# EAGLE design AirPi1-4 (EAGLE 6.5.0)
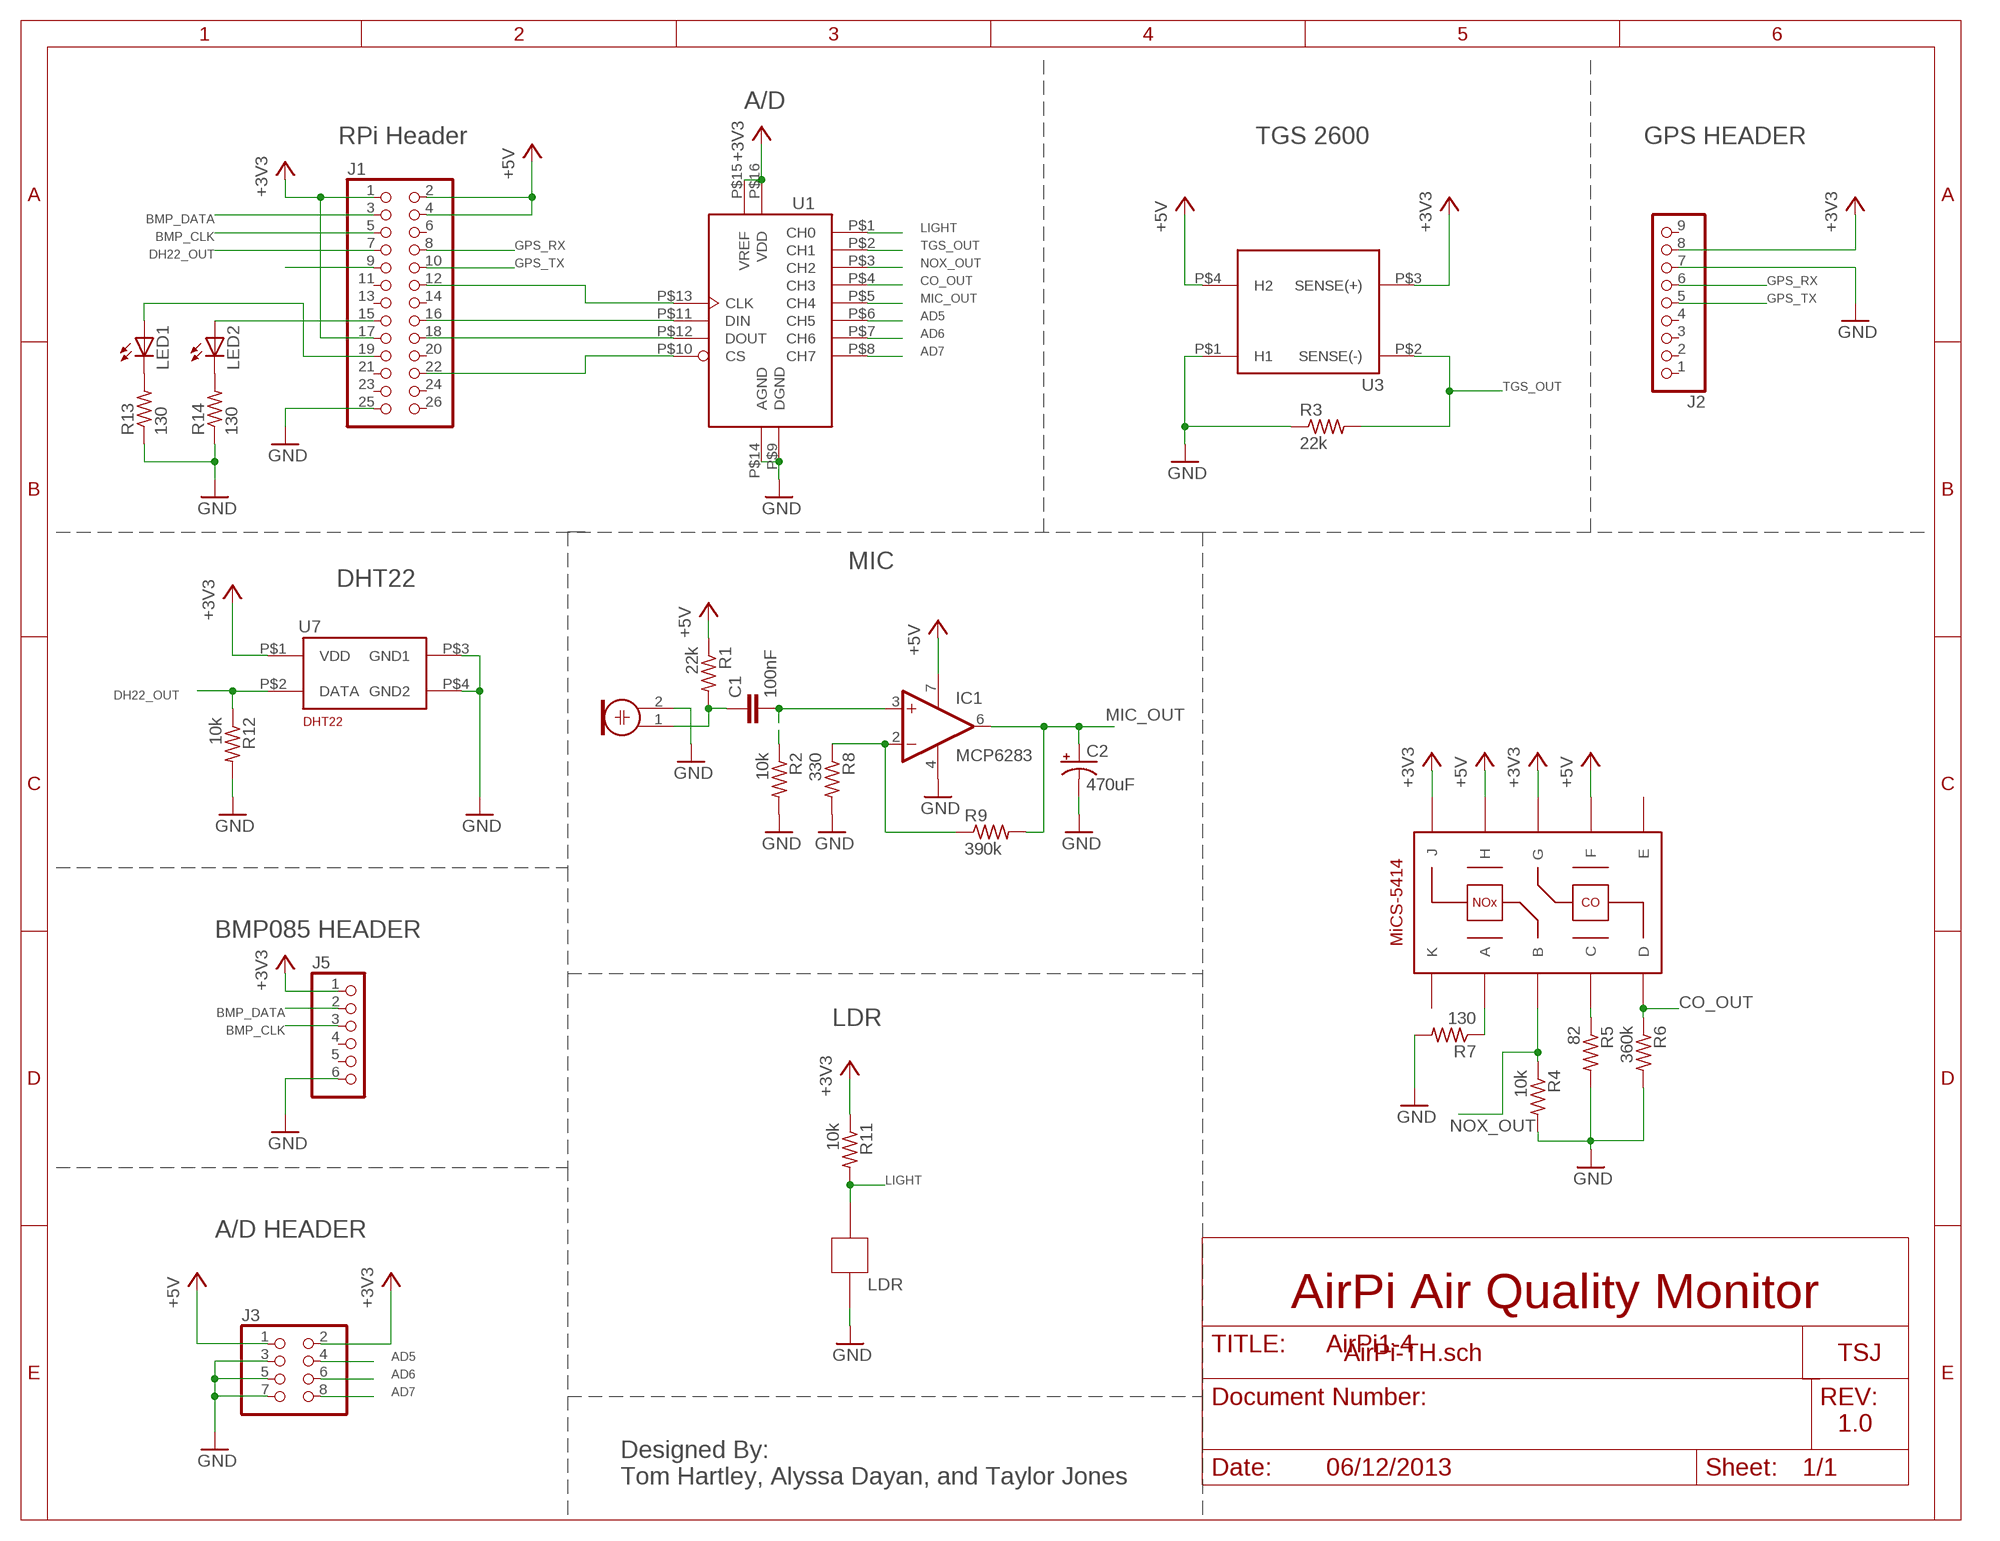
[diagram p0: schematic, sheet 1]

## Parts
C1  100nF  C2.5/4  [C2.5-4]
C2  470uF  CPOL-USE3.5-8  [E3,5-8]
IC1  MCP6283  OPA344P  [DIL08]
IC2  MCP3008  MCP30081  [DIL16]
J1  PINHD-2X13  [2X13]
J2  PINHD-1X9  [1X09-BIG]
J3  PINHD-2X4  [2X04]
J5  PINHD-1X6  [1X06]
LDR1  LDR  [LED5MM]
LED1  LED3MM  [LED3MM]
LED2  LED3MM  [LED3MM]
M1  MIC  ELECTRET_MICROPHON-WM-62PC/62PK  [WM-62PC/62PK]
MICS  MICS-4514  [MICS-4514]
R1  22k  R-US_0207/10  [0207/10]
R2  10k  R-US_0207/10  [0207/10]
R3  22k  R-US_0207/10  [0207/10]
R4  10k  R-US_0207/10  [0207/10]
R5  82  R-US_0207/10  [0207/10]
R6  360k  R-US_0207/10  [0207/10]
R7  130  R-US_0207/10  [0207/10]
R8  330  R-US_0207/10  [0207/10]
R9  390k  R-US_0207/10  [0207/10]
R11  10k  R-US_0207/10  [0207/10]
R12  10k  R-US_0207/10  [0207/10]
R13  130  R-US_0207/10  [0207/10]
R14  130  R-US_0207/10  [0207/10]
U3  TGS2600  [TGS2600]
U7  DHT22  [DHT22]

## Nets
+3V3 [power]: IC2.P$15(VREF) IC2.P$16(VDD) J1.1 J1.17 J2.8 J3.2 J5.1 MICS.G MICS.J R11.1 U3.P$3(SENSE(+)) U7.P$1(VDD)
+5V [power]: IC1.7(V+) J1.2 J1.4 J3.1 MICS.F MICS.H R1.1 U3.P$4(H2)
AD5: IC2.P$6(CH5) J3.4
AD6: IC2.P$7(CH6) J3.6
AD7: IC2.P$8(CH7) J3.8
BMP_CLK: J1.5 J5.3
BMP_DATA: J1.3 J5.2
CO_OUT: IC2.P$4(CH3) MICS.D R6.1
DH22_OUT: J1.7 R12.1 U7.P$2(DATA)
GND: C2.- IC1.4(V-) IC2.P$9(DGND) IC2.P$14(AGND) J1.25 J2.7 J3.3 J3.5 J3.7 J5.6 LDR1.K M1.2 R2.2 R3.1 R4.2 R5.2 R6.2 R7.2 R8.2 R12.2 R13.1 R14.1 U3.P$1(H1) U7.P$3(GND1) U7.P$4(GND2)
GPS_RX: J1.8 J2.6
GPS_TX: J1.10 J2.5
LIGHT: IC2.P$1(CH0) LDR1.A R11.2
MIC_OUT: C2.+ IC1.6(OUT) IC2.P$5(CH4) R9.2
N$1: IC2.P$13(CLK) J1.12
N$2: IC2.P$12(DOUT) J1.18
N$3: IC2.P$10(CS) J1.22
N$4: IC2.P$11(DIN) J1.16
N$6: MICS.C R5.1
N$7: C1.1 M1.1 R1.2
N$8: C1.2 IC1.3(+IN) R2.1
N$10: IC1.2(-IN) R8.1 R9.1
N$11: MICS.A R7.1
N$13: J1.9
N$18: LED1.K(C) R13.2
N$19: LED2.K(C) R14.2
N$21: J1.19 LED1.A
N$22: J1.15 LED2.A
NOX_OUT: IC2.P$3(CH2) MICS.B R4.1
TGS_OUT: IC2.P$2(CH1) R3.2 U3.P$2(SENSE(-))
Unconnected: J1.6 J1.11 J1.13 J1.14 J1.20 J1.21 J1.23 J1.24 J1.26 J2.1 J2.2 J2.3 J2.4 J2.9 J5.4 J5.5 MICS.E MICS.K

## Notes on the sheet
- A/D
- RPi Header | TGS 2600 | GPS HEADER
- U1
- U3
- MIC
- DHT22
- U7
- BMP085 HEADER
- LDR
- A/D HEADER
- LDR
- AirPi Air Quality Monitor
- AirPi-TH.sch | TSJ
- 1.0
- 06/12/2013
- Designed By:
  Tom Hartley, Alyssa Dayan, and Taylor Jones

## Library data of the parts
C1 = capacitor-wima:C: CAPACITOR naming: grid - package width
C2 = rcl:CPOL-US: POLARIZED CAPACITOR, American symbol
IC1 = linear:OPA*: Single Operational Amplifier Low Power, Single-Supply, Rail-To-Rail Operational Amplifier Source: http://focus.ti.com/lit/ds/symlink/opa2345.pdf
IC2 = tjones:MCP3008
J1 = pinhead:PINHD-2X13: PIN HEADER
J2 = adafruit:PINHD-1X9: Pin header 1x10 0.1" spacing With round pins
J3 = adafruit:PINHD-2X4: PIN HEADER
J5 = adafruit:PINHD-1X6: PIN HEADER
LDR1 = tjones:LDR
LED1 LED2 = adafruit:LED: LED OSRAM: - CHIPLED LG R971, LG N971, LY N971, LG Q971, LY Q971, LO R971, LY R971 LH N974, LH R974 LS Q976, LO Q976, LY Q976 LO Q996 - Hyper CHIPLED LW Q18S LB Q993, LB Q99A, LB R99A - SideLED LS A670, LO A670, LY A670, LG A670, LP A670 LB A673, LV A673, LT A673, LW A673 LH A674 LY A675 LS A676, LA A676, LO A676, LY A676, LW A676 LS A679, LY A679, LG A679 - Hyper Micro SIDELED® LS Y876, LA Y876, LO Y876, LY Y876 LT Y87S - SmartLED LW L88C, LW L88S LB L89C, LB L89S, LG L890 LS L89K, LO L89K, LY L89K LS L896, LA L896, LO L896, LY L896 - TOPLED LS T670, LO T670, LY T670, LG T670, LP T670 LSG T670, LSP T670, LSY T670, LOP T670, LYG T670 LG T671, LOG T671, LSG T671 LB T673, LV T673, LT T673, LW T673 LH T674 LS T676, LA T676, LO T676, LY T676, LB T676, LH T676, LSB T676, LW T676 LB T67C, LV T67C, LT T67C, LS T67K, LO T67K, LY T67K, LW E67C LS E67B, LA E67B, LO E67B, LY E67B, LB E67C, LV E67C, LT E67C LW T67C LS T679, LY T679, LG T679 LS T770, LO T770, LY T770, LG T770, LP T770 LB T773, LV T773, LT T773, LW T773 LH T774 LS E675, LA E675, LY E675, LS T675 LS T776, LA T776, LO T776, LY T776, LB T776 LHGB T686 LT T68C, LB T68C - Hyper Mini TOPLED® LB M676 - Mini TOPLED Santana® LG M470 LS M47K, LO M47K, LY M47K Source: http://www.osram.convergy.de/
M1 = microphon:ELECTRET_MICROPHON-: Electret Condenser Microphone
MICS = TH:MICS-4514
R1-R9 R11-R14 = adafruit:R-US_: RESISTOR, American symbol
U3 = tjones:TGS2600
U7 = tjones:DHT22

## Net classes
0 signal: width 0.203 mm, drill 0.001 mm
1 power: width 0.406 mm, drill 0.001 mm

## Board
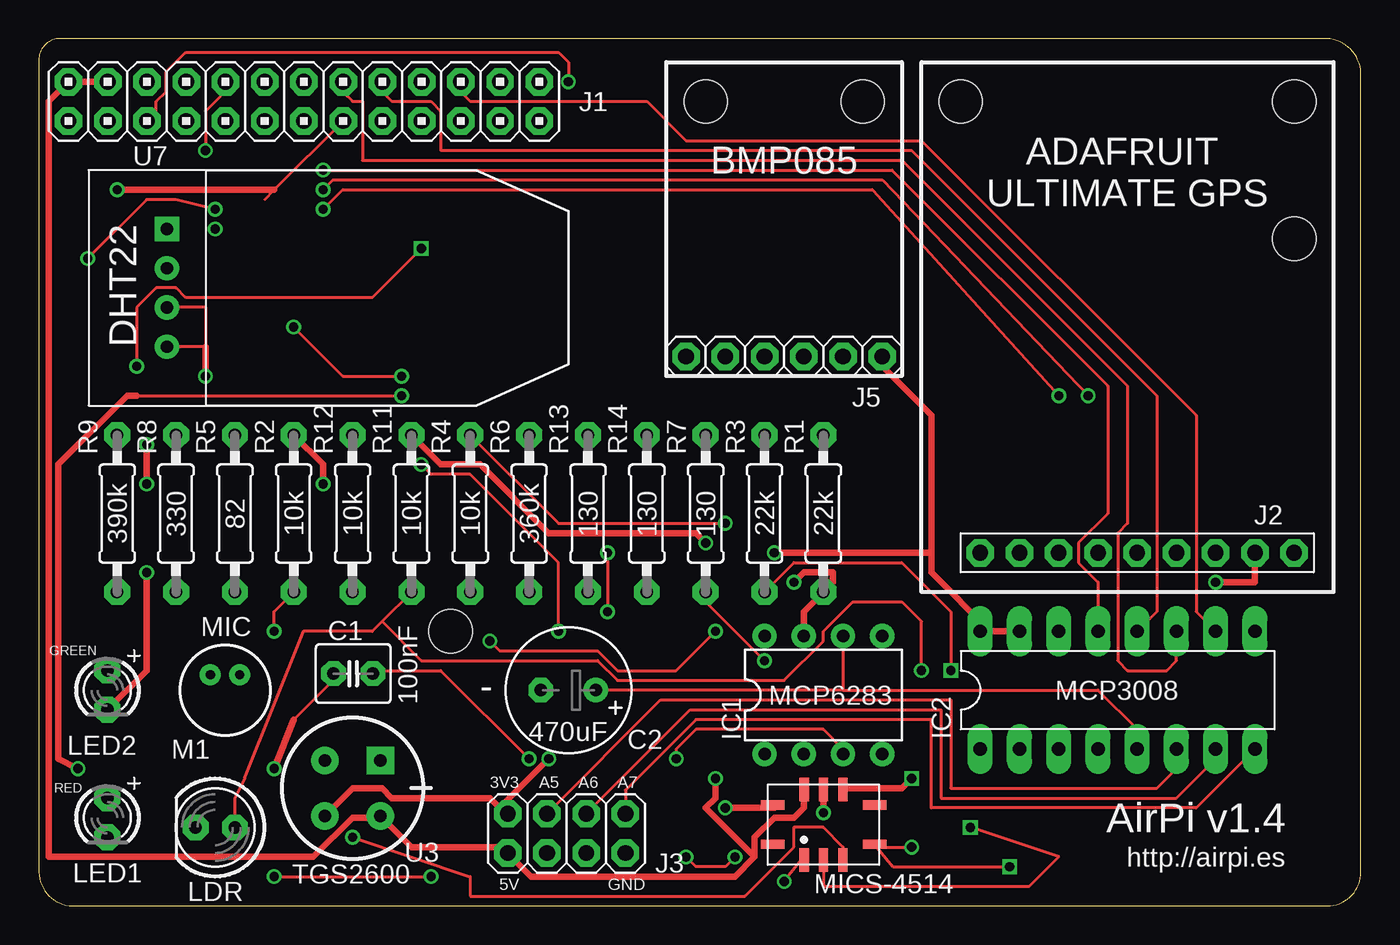
[diagram p1: board, top side]
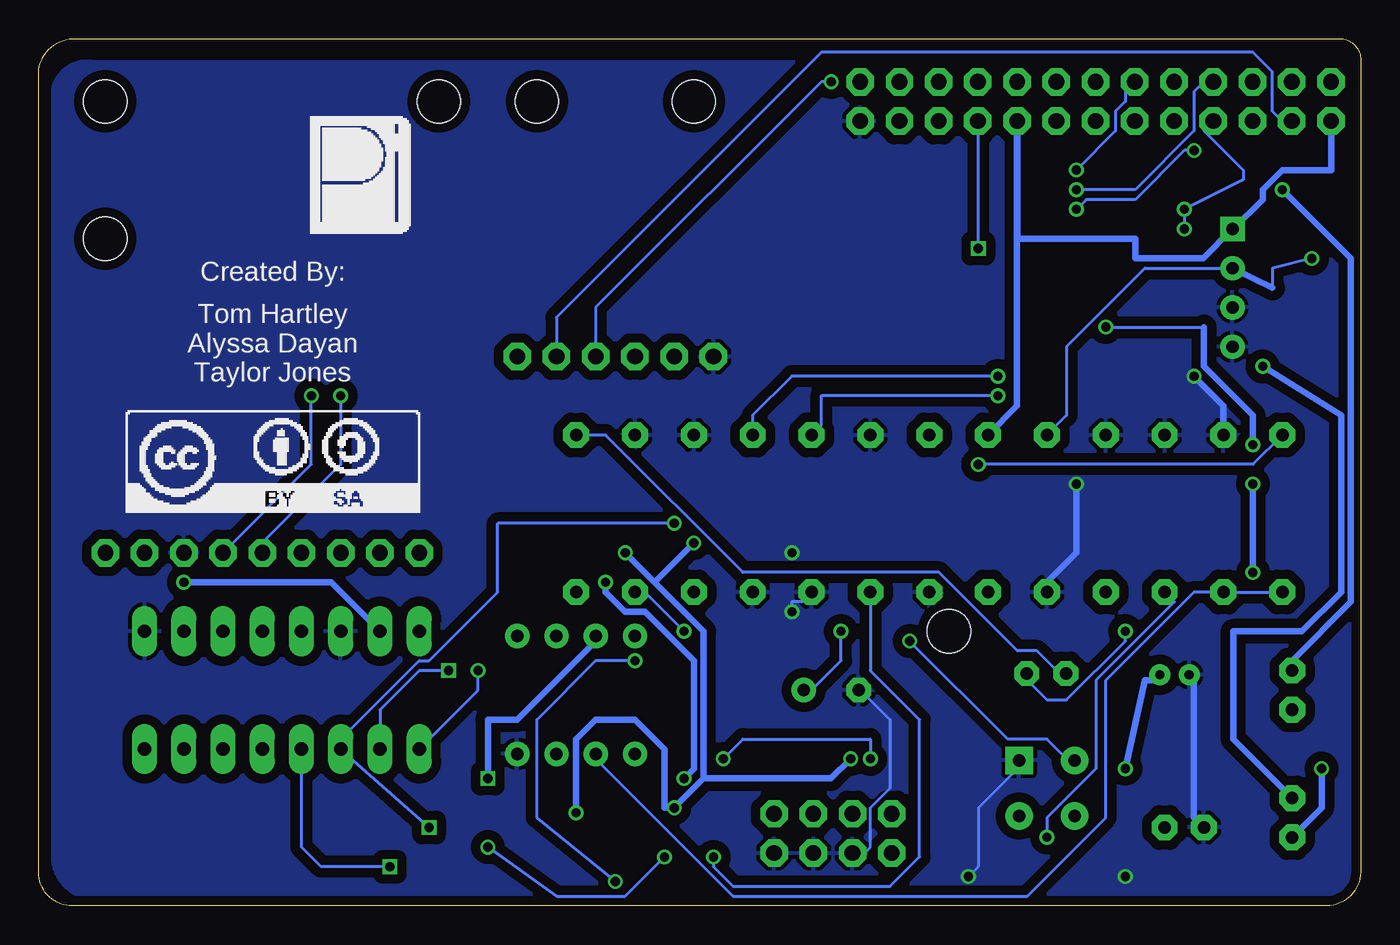
[diagram p2: board, bottom side, seen from below]

Size 85.61 x 56.13 mm. Coordinates in mm from the lower left corner, seen from the top.
Outline: 0.01,54.6 0.01,2.19 arc90 2.39,0 83.42,0 arc90 85.6,2.19 85.6,53.7 arc90 83.42,56.13 1.29,56.13 arc90 0.01,54.6
Copper layers (1*16): Top 0.0356mm / dielectric 1.5011mm / Bottom 0.0356mm
Design rules "LaenPCBOrder *": minimum track width 6mil, minimum drill 13mil, track to track 6mil, track to pad 6mil, pad to pad 6mil, via to via 6mil, smd to smd 6mil, copper to edge 15mil, drill to drill 6mil, minimum pad ring 15mil, minimum via ring 7mil, stop-mask expansion 4mil, vias tented up to drill 0mil, thermal gap 10mil
Holes 2.8 mm at 26.68,17.78 81.29,43.18 53.35,52.07 81.29,52.07 59.7,52.07 43.19,52.07

### Footprints (pad centres in the part's own frame; a part is rotated, then mirrored left to right if it is on the bottom)
C2.5-4 = drill 0.813 pad 1.6 octagon: 1 -1.27,0; 2 1.27,0
E3,5-8 = drill 0.813 pad 1.6: + -1.778,0 | drill 0.813 pad 1.6 octagon: - 1.778,0
DIL08 = drill 0.813 pad 1.27: 1 -3.81,-3.81; 2 -1.27,-3.81; 3 1.27,-3.81; 4 3.81,-3.81; 5 3.81,3.81; 6 1.27,3.81; 7 -1.27,3.81; 8 -3.81,3.81
DIL16 = drill 0.864 long: P$1 -8.89,-3.81; P$2 -6.35,-3.81; P$3 -3.81,-3.81; P$4 -1.27,-3.81; P$5 1.27,-3.81; P$6 3.81,-3.81; P$7 6.35,-3.81; P$8 8.89,-3.81; P$9 8.89,3.81; P$10 6.35,3.81; P$11 3.81,3.81; P$12 1.27,3.81; P$13 -1.27,3.81; P$14 -3.81,3.81; P$15 -6.35,3.81; P$16 -8.89,3.81
2X13 = drill 1.016 octagon: 1 -15.24,-1.27; 2 -15.24,1.27; 3 -12.7,-1.27; 4 -12.7,1.27; 5 -10.16,-1.27; 6 -10.16,1.27; 7 -7.62,-1.27; 8 -7.62,1.27; 9 -5.08,-1.27; 10 -5.08,1.27; 11 -2.54,-1.27; 12 -2.54,1.27; 13 0,-1.27; 14 0,1.27; 15 2.54,-1.27; 16 2.54,1.27; 17 5.08,-1.27; 18 5.08,1.27; 19 7.62,-1.27; 20 7.62,1.27; 21 10.16,-1.27; 22 10.16,1.27; 23 12.7,-1.27; 24 12.7,1.27; 25 15.24,-1.27; 26 15.24,1.27
1X09-BIG = drill 1.016 pad 1.778 octagon: 1 -10.16,0; 2 -7.62,0; 3 -5.08,0; 4 -2.54,0; 5 0,0; 6 2.54,0; 7 5.08,0; 8 7.62,0; 9 10.16,0
2X04 = drill 1.016 pad 1.676 octagon: 1 -3.81,-1.27; 2 -3.81,1.27; 3 -1.27,-1.27; 4 -1.27,1.27; 5 1.27,-1.27; 6 1.27,1.27; 7 3.81,-1.27; 8 3.81,1.27
1X06 = drill 1.016 octagon: 1 -6.35,0; 2 -3.81,0; 3 -1.27,0; 4 1.27,0; 5 3.81,0; 6 6.35,0
LED5MM = drill 0.813 pad 1.676 octagon: A -1.27,0; K 1.27,0
LED3MM = drill 0.813 pad 1.676 octagon: A -1.27,0; K 1.27,0
WM-62PC/62PK = drill 0.6 pad 1: 1 -1,0.95; 2 -1,-0.95
MICS-4514 = smd 0.6 x 1.524: A -1.25,-2.286; B 0,-2.286; C 1.25,-2.286; F 1.25,2.286; G 0,2.286; H -1.25,2.286 | smd 1.524 x 0.6: D 3.302,-1.27; E 3.302,1.27; J -3.302,1.27; K -3.302,-1.27
0207/10 = drill 0.813 pad 1.676 octagon: 1 -5.08,0; 2 5.08,0
TGS2600 = drill 0.8 pad 1.778 square: P$1 -1.803,1.803 | drill 0.8 pad 1.778: P$2 -1.803,-1.803; P$3 1.803,-1.803; P$4 1.803,1.803
DHT22 = drill 0.8 square: P$1 0,0 | drill 0.8: P$2 2.54,0; P$3 5.08,0; P$4 7.62,0

### Placement (x,y rotation side)
C1  20.36,15.04 0 top
C2  34.3,13.97 180 top
IC1  50.81,13.65 0 top
IC2  69.86,13.97 0 top
J1  17.18,52.07 0 top
J2  71.13,22.86 0 top
J3  34.18,4.7 0 top
J5  48.27,35.56 180 top
LDR1  11.44,5.08 180 top
LED1  4.45,5.71 270 top
LED2  4.45,13.97 270 top
M1  12.07,13.97 270 top
MICS  50.82,5.27 0 top
R1  50.81,25.4 90 top
R2  16.52,25.4 90 top
R3  47,25.4 270 top
R4  27.95,25.4 270 top
R5  12.71,25.4 90 top
R6  31.76,25.4 90 top
R7  43.19,25.4 90 top
R8  8.9,25.4 90 top
R9  5.09,25.4 90 top
R11  24.14,25.4 270 top
R12  20.33,25.4 270 top
R13  35.57,25.4 90 top
R14  39.38,25.4 90 top
U3  20.33,7.62 270 top
U7  8.31,43.81 270 top

### Tracks (layer width: path | path; a pad name or v marks a point on that pad's centre or on a via)
+3V3  (via drill 0.6)
  Top 0.406: U3.P$3 20.33,7.62 22.23,7.62 22.87,6.99 29.22,6.99 29.85,6.35 | 29.85,6.35 v33.03,9.53 | 29.85,6.35 J3.2 | v44.46,6.35 47.63,6.35 MICS.J | 61.6,17.78 IC2.P$15 | v76.21,20.95 78.75,20.95 J2.8 | 57.79,22.86 57.79,21.59 61.6,17.78 | 57.79,22.86 57.79,31.75 54.62,34.92 J5.1 | 61.6,17.78 IC2.P$16 | v47.63,22.86 57.79,22.86 | v43.19,23.5 42.55,24.13 33.03,24.13 28.58,28.57 26.04,28.57 R11.1 | 50.81,7.62 MICS.G 50.81,6.99 v50.81,6.03
  Bottom 0.406: 42.55,8.26 34.3,8.26 v33.03,9.53 | 42.55,8.26 v44.46,6.35 45.09,6.35 45.09,10.16 47,12.06 49.54,12.06 50.81,10.79 v50.81,6.03 | v76.21,20.95 66.68,20.95 IC2.P$15 | 45.73,20.95 42.55,17.78 42.55,8.26 | 45.73,20.95 v47.63,22.86 | v43.19,23.5 45.73,20.95 | J1.1 1.91,50.8 1.91,47.62 5.09,47.62 6.36,46.35 6.36,45.72 8.26,43.81 U7.P$1 10.22,41.91 14.61,41.91 14.61,43.18 22.23,43.18 22.23,50.8 J1.17 22.26,32.36 R11.1
+5V  (via drill 0.6)
  Top 0.406: IC1.7 49.54,19.05 R1.1 51.44,20.95 51.44,21.59 49.54,21.59 v48.9,20.95 | v56.52,8.26 55.89,7.62 52.08,7.62 52.07,7.61 MICS.F | 46.36,3.17 45.09,1.91 31.9,1.91 J3.1 29.85,3.81 24.14,3.81 U3.P$4 21.6,5.71 20.33,5.71 17.79,3.17 0.64,3.17 0.64,52.07 1.91,53.34 J1.2 J1.4 | 46.36,3.17 46.36,4.45 47.63,5.71 48.9,5.71 49.54,6.35 49.54,6.99 MICS.H | v43.82,8.26 43.82,6.99 43.19,6.35 46.36,3.17
  Bottom 0.406: v56.52,8.26 56.52,12.06 54.62,12.06 49.54,17.14 IC1.7 | v48.9,20.95 48.9,20.32 47.63,19.05 46.36,19.05 43.19,15.88 43.19,8.89 v43.82,8.26
AD5
  Top 0.203: J3.4 40.28,13.34 59.06,13.34 59.06,7.62 72.4,7.62 73.67,8.89 IC2.P$6
AD6
  Top 0.203: J3.6 42.18,12.7 58.43,12.7 58.43,6.99 73.67,6.99 76.21,9.53 IC2.P$7
AD7
  Top 0.203: IC2.P$8 74.94,6.35 57.79,6.35 57.79,12.06 42.55,12.06 37.99,7.51 J3.8
BMP_CLK  (via drill 0.6)
  Top 0.203: v34.3,53.34 34.3,54.61 33.66,55.24 9.53,55.24 8.26,53.98 8.26,52.7 7.63,52.07 7.63,50.8 J1.5
  Bottom 0.203: J5.3 49.54,38.73 34.93,53.34 v34.3,53.34
BMP_DATA
  Bottom 0.203: J5.2 52.08,38.1 34.93,55.24 6.99,55.24 5.72,53.98 5.72,51.44 5.09,50.8 J1.3
CO_OUT  (via drill 0.6)
  Top 0.203: v62.87,2.54 55.31,2.54 MICS.D 53.98,3.81 v56.52,3.81 | v41.92,3.17 42.55,2.54 44.46,2.54 v45.09,3.17
  Bottom 0.203: v62.87,2.54 67.32,2.54 68.59,3.81 IC2.P$4 | R6.1 31.76,15.24 28.58,12.06 28.58,3.17 30.49,1.27 40.65,1.27 41.92,2.54 v41.92,3.17 | v45.09,3.17 47.63,0.64 52.08,0.64 v56.52,3.81
DH22_OUT  (via drill 0.6)
  Top 0.203: v3.18,41.91 6.99,45.72 8.9,45.72 v11.44,45.09
  Bottom 0.203: R12.1 19.06,31.75 19.06,36.2 13.98,41.27 U7.P$2 | J1.7 10.17,50.8 10.17,50.16 7.63,47.62 7.63,46.99 v11.44,45.09 v11.44,43.81 | 5.72,40.01 5.72,41.27 v3.18,41.91
  Bottom 0.406: 5.72,40.01 U7.P$2
GND  (via drill 0.6)
  Top 0.203: v36.84,22.86 v36.84,19.05 | v15.25,1.91 v25.41,1.91 | U7.P$3 10.8,38.73 10.8,36.2 U7.P$4
  Top 0.406: 10.8,36.2 v10.8,34.29 | v18.42,27.3 18.42,28.57 R2.2
  Bottom 0.203: J3.3 32.39,3.17 31.76,3.81 31.76,6.35 30.49,7.62 30.49,12.06 32.39,13.97 C2.- | R13.1 36.2,19.68 36.84,19.68 v36.84,19.05 | U3.P$1 22.23,8.89 24.77,6.35 24.77,2.54 v25.41,1.91
  Bottom 0.406: R8.2 8.9,32.38 v10.8,34.29 | v18.42,27.3 18.42,22.86 20.33,20.95 R12.2 | M1.2 10.8,14.61 10.8,5.71 LDR1.K
  pour Bottom (isolate 0.61): 0.62,54.62 82.01,54.61 arc-90 84.7,52.85 84.7,3.2 arc-90 81.89,0.46 3.07,0.46 arc-90 0.62,2.17
GPS_RX  (via drill 0.6)
  Top 0.203: v67.95,33.02 54.62,46.99 19.06,46.99 v18.42,46.35
  Bottom 0.203: v67.95,33.02 67.95,28.57 J2.6 | v18.42,46.35 14.61,46.35 10.8,50.16 10.8,52.7 10.17,53.34 J1.8
GPS_TX  (via drill 0.6)
  Top 0.203: v66.05,33.02 53.98,46.35 19.69,46.35 v18.42,45.09 | v10.8,48.9 10.8,51.44 12.71,53.34 J1.10
  Bottom 0.203: J2.5 71.13,23.5 66.05,28.57 v66.05,33.02 | v18.42,45.09 17.79,45.72 14.61,45.72 11.44,48.9 v10.8,48.9
LIGHT  (via drill 0.6)
  Top 0.203: R11.2 22.23,18.41 | 22.23,18.41 21.6,17.78 17.15,17.78 13.34,8.26 12.71,6.99 LDR1.A | 22.23,18.41 24.77,15.88 36.2,15.88 37.47,14.61 48.27,14.61 50.81,17.14 50.81,17.78 52.71,19.68 55.89,19.68 57.16,18.41 v57.16,15.24
  Bottom 0.203: v57.16,15.24 57.16,13.97 IC2.P$1
MIC_OUT  (via drill 0.6)
  Top 0.203: 52.08,13.97 68.59,13.97 71.13,11.43 IC2.P$5 | IC1.6 52.08,13.97 | 52.08,13.97 51.76,13.97 C2.+ | v24.77,28.57 25.41,27.94 27.95,27.94 33.66,22.23 v33.66,17.78
  Bottom 0.203: v24.77,28.57 6.99,28.57 R9.2 | v33.66,17.78 33.66,15.88 35.57,13.97 C2.+
N$1  (via drill 0.6)
  Top 0.203: IC2.P$13 68.59,20.95 67.32,22.23 67.32,23.5 69.22,25.4 69.22,33.66 55.25,47.62 v18.42,47.62
  Bottom 0.203: v18.42,47.62 15.88,50.16 15.88,51.44 15.25,52.07 15.25,53.34 J1.12
N$2
  Top 0.203: J1.18 22.26,52.68 22.87,52.07 25.41,52.07 26.04,51.44 26.04,48.9 56.52,48.9 72.4,33.02 72.4,19.05 IC2.P$12
N$3
  Top 0.203: J1.22 27.34,52.68 27.95,52.07 39.38,52.07 41.92,49.53 57.16,49.53 74.94,31.75 74.94,19.05 IC2.P$10
N$4
  Top 0.203: J1.16 19.72,52.73 19.69,52.7 20.33,52.07 20.96,52.07 20.96,48.26 55.89,48.26 70.49,33.66 70.49,24.77 69.86,24.13 69.86,15.88 70.49,15.24 73.03,15.24 73.67,15.88 IC2.P$11
N$6  (via drill 0.6)
  Top 0.203: MICS.C 52.08,3.17 52.08,3.81 50.81,5.08 48.9,5.08 48.9,3.81 45.73,0.64 27.95,0.64 27.95,1.91 v20.33,4.45
  Bottom 0.203: v20.33,4.45 20.33,5.71 17.15,8.89 17.15,14.61 12.07,19.68 R5.1
N$7  (via drill 0.6)
  Top 0.203: 16.52,12.06 19.06,14.61 C1.1
  Top 0.406: 16.52,12.06 v15.25,8.89
  Bottom 0.203: R1.2 48.9,30.48 40.01,21.59 27.31,21.59 22.23,16.51 20.96,16.51 19.69,15.24 C1.1
  Bottom 0.406: v15.25,8.89 13.98,14.61 13.34,14.61 M1.1
N$8  (via drill 0.6)
  Top 0.203: v15.25,17.78 15.25,19.05 R2.1 | v31.76,9.53 26.04,15.24 22.23,15.24 C1.2 | v41.28,9.53 41.28,10.16 42.55,11.43 50.81,11.43 52.08,10.16 IC1.3
  Bottom 0.203: v15.25,17.78 15.25,17.14 19.06,13.34 20.33,13.34 21.6,14.61 C1.2 | v41.28,9.53 40.01,10.79 31.76,10.79 v31.76,9.53
N$10
  Bottom 0.203: R9.1 R8.1 10.8,20.32 16.52,14.61 16.52,5.71 21.6,0.64 40.65,0.64 49.54,9.53 IC1.2
N$11  (via drill 0.6)
  Top 0.203: v47,15.88 43.19,19.68 R7.1 | v48.27,1.59 49.54,3.17 MICS.A
  Bottom 0.203: v47,15.88 49.54,15.88 53.35,12.06 53.35,5.71 v48.27,1.59
N$18  (via drill 0.6)
  Top 0.203: 6.36,33.02 v23.5,33.02
  Top 0.406: v2.55,8.89 1.28,9.53 1.28,28.57 5.72,33.02 6.36,33.02
  Bottom 0.203: v23.5,33.02 34.93,33.02 34.93,31.11 R13.2
  Bottom 0.406: LED1.K 2.55,6.35 v2.55,8.89
N$19  (via drill 0.6)
  Top 0.203: v23.5,34.29 19.69,34.29 v16.52,37.47
  Top 0.406: v6.99,21.59 6.99,15.24 LED2.K | v6.99,29.84 v6.99,27.3
  Bottom 0.203: v16.52,37.47 10.17,37.47 | v23.5,34.29 36.84,34.29 39.38,31.75 R14.2
  Bottom 0.406: v6.99,27.3 v6.99,21.59 | v6.99,29.84 6.99,31.75 10.17,34.92 10.17,37.47
N$21  (via drill 0.6)
  Top 0.203: v6.36,34.92 6.36,38.73 7.63,40.01 8.9,40.01 9.53,39.37 21.6,39.37 v24.77,42.55
  Bottom 0.203: v24.77,42.55 24.77,50.77 J1.19
  Bottom 0.406: LED1.A 8.26,10.79 8.26,17.78 3.82,17.78 1.28,20.32 1.28,31.75 v6.36,34.92
N$22  (via drill 0.6)
  Top 0.203: 14.64,45.72 15.26,46.34 J1.15
  Top 0.406: v5.09,46.35 15.25,46.35 15.26,46.34
  Bottom 0.406: LED2.A 4.45,15.88 0.64,19.68 0.64,41.91 v5.09,46.35
NOX_OUT  (via drill 0.6)
  Top 0.203: MICS.B 50.81,3.25 50.81,1.27 64.14,1.27 66.05,3.17 v60.33,5.08 | v44.46,24.77 33.66,24.77 R4.1
  Bottom 0.203: v60.33,5.08 IC2.P$3 66.05,10.79 60.97,15.88 60.33,15.88 55.89,20.32 55.89,24.77 v44.46,24.77
TGS_OUT  (via drill 0.6)
  Top 0.203: R3.2 48.9,22.23 55.89,22.23 59.06,19.05 v59.06,15.24 | v43.82,17.78 41.28,15.24 37.47,15.24 36.2,16.51 29.85,16.51 v29.22,17.14
  Bottom 0.203: v59.06,15.24 60.97,15.24 63.51,12.7 IC2.P$2 | R3.2 46.36,20.32 v43.82,17.78 | v29.22,17.14 22.87,10.79 20.33,10.79 19.06,9.53 U3.P$2

### Text on the board
tPlace: BMP085 | ADAFRUIT / ULTIMATE GPS | DHT22 | - | 3V3 | A5 | A6 | A7 | AirPi v1.4 | 5V | GND
tNames: GREEN | RED | http://airpi.es | TGS2600 | /home/t/eagle/AirPi/share-alike-jpeg.bmp
bNames: Created By: | Tom Hartley / Alyssa Dayan / Taylor Jones
bStop: Alice